# Altium schematic sheet DC_DC Convertor.SchDoc
size A4; SheetNumber: 3; SheetTotal: 10
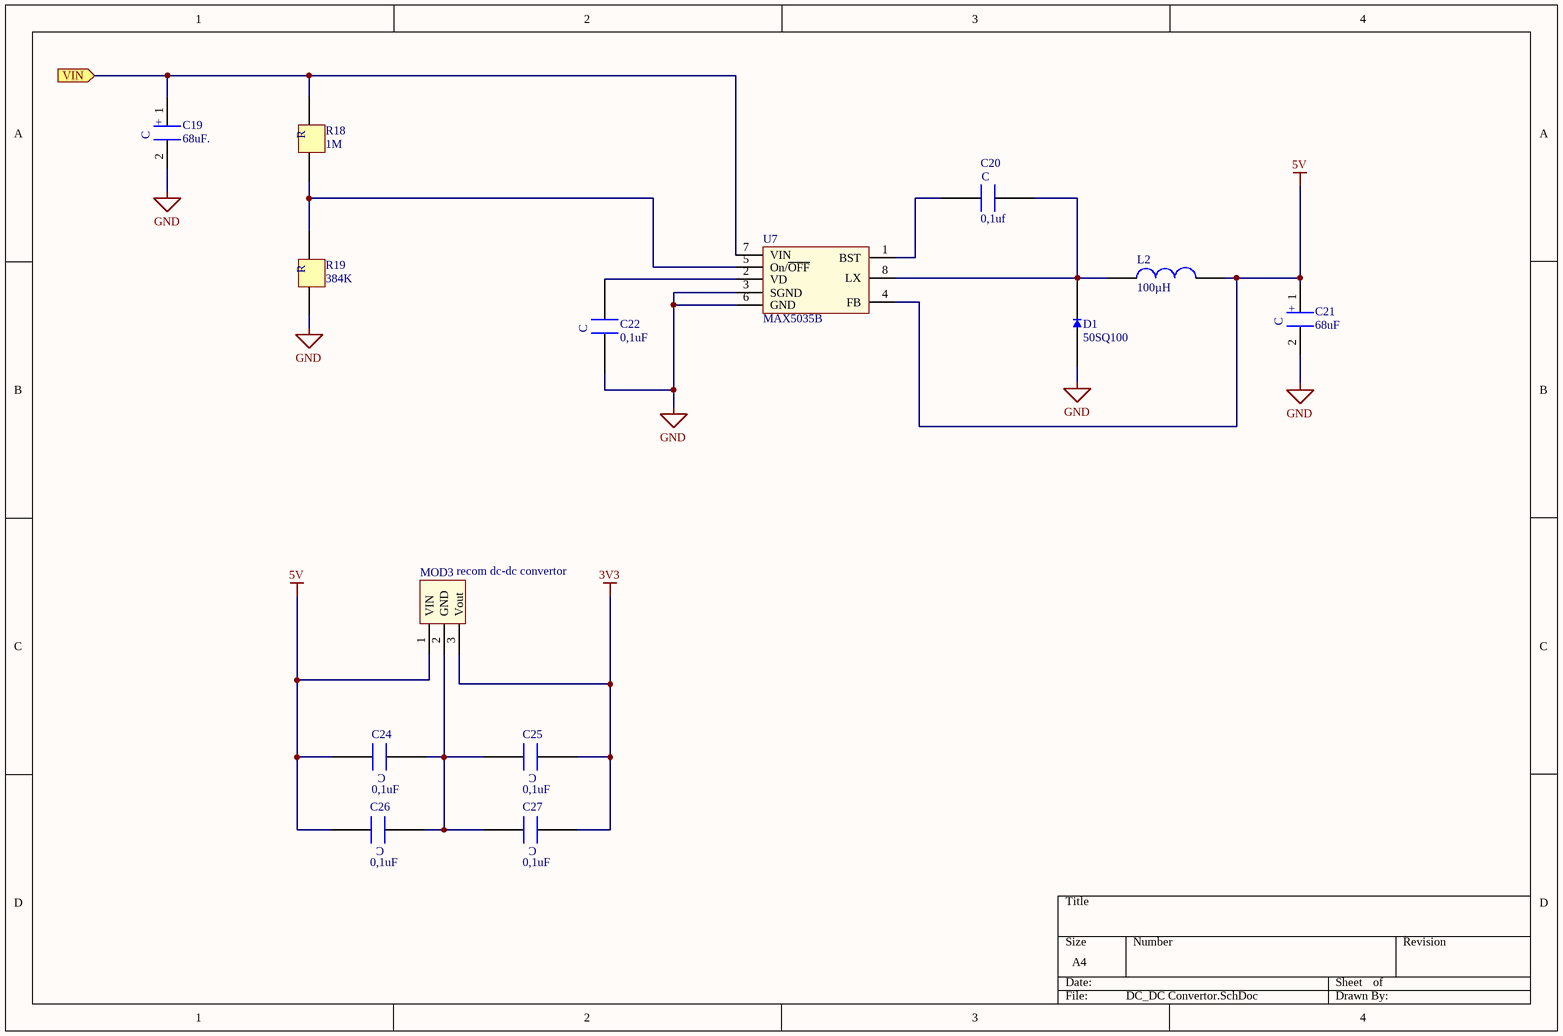
[diagram p0: DC_DC Convertor.SchDoc]

## Parts
C19  68uF.
C20  0,1uf  [0603]
C21  68uF
C22  0,1uF  [CAPC1005X04L]
C24  0,1uF  [0603]
C25  0,1uF  [0603]
C26  0,1uF  [0603]
C27  0,1uF  [0603]
D1  50SQ100  [TROUGH HOLE DIODE]
L2  100µH  [Coilcraft , XFL4020-102]
MOD3  recom dc-dc convertor
R18  1M  [0603]
R19  384K  [0603]
U7  MAX5035B  [SOICN8]

## Ports
VIN (in)

## Nets
3V3: C25.2 C27.2 MOD3.3(Vout)
5V: C21.1 C24.1 C26.1 L2.1 MOD3.1(VIN) U7.4(FB)
GND: C19.2 C21.2 C22.2 D1.1 R19.2 U7.3(SGND) U7.6(GND)
VIN: C19.1 R18.1 U7.7(VIN) ; port VIN
NetC20_1: C20.1 D1.2 L2.2 U7.8(LX)
NetC20_2: C20.2 U7.1(BST)
NetC22_1: C22.1 U7.2(VD)
NetC24_2: C24.2 C25.1 C26.2 C27.1 MOD3.2(GND)
NetR18_2: R18.2 R19.1 U7.5(On/~{OFF})

## Notes on the sheet
- (in symbol cap_pol) +; C
- (in symbol capacitor) C
- (in symbol resistor) R

## Library data of the parts
C19 C21 = cap_pol
C20 C22 C24-C27 = capacitor
D1 = diode
L2 = Spoel
R18 R19 = resistor
U7 = MAX5035